# EAGLE schematic eletric (EAGLE 9.6.2)
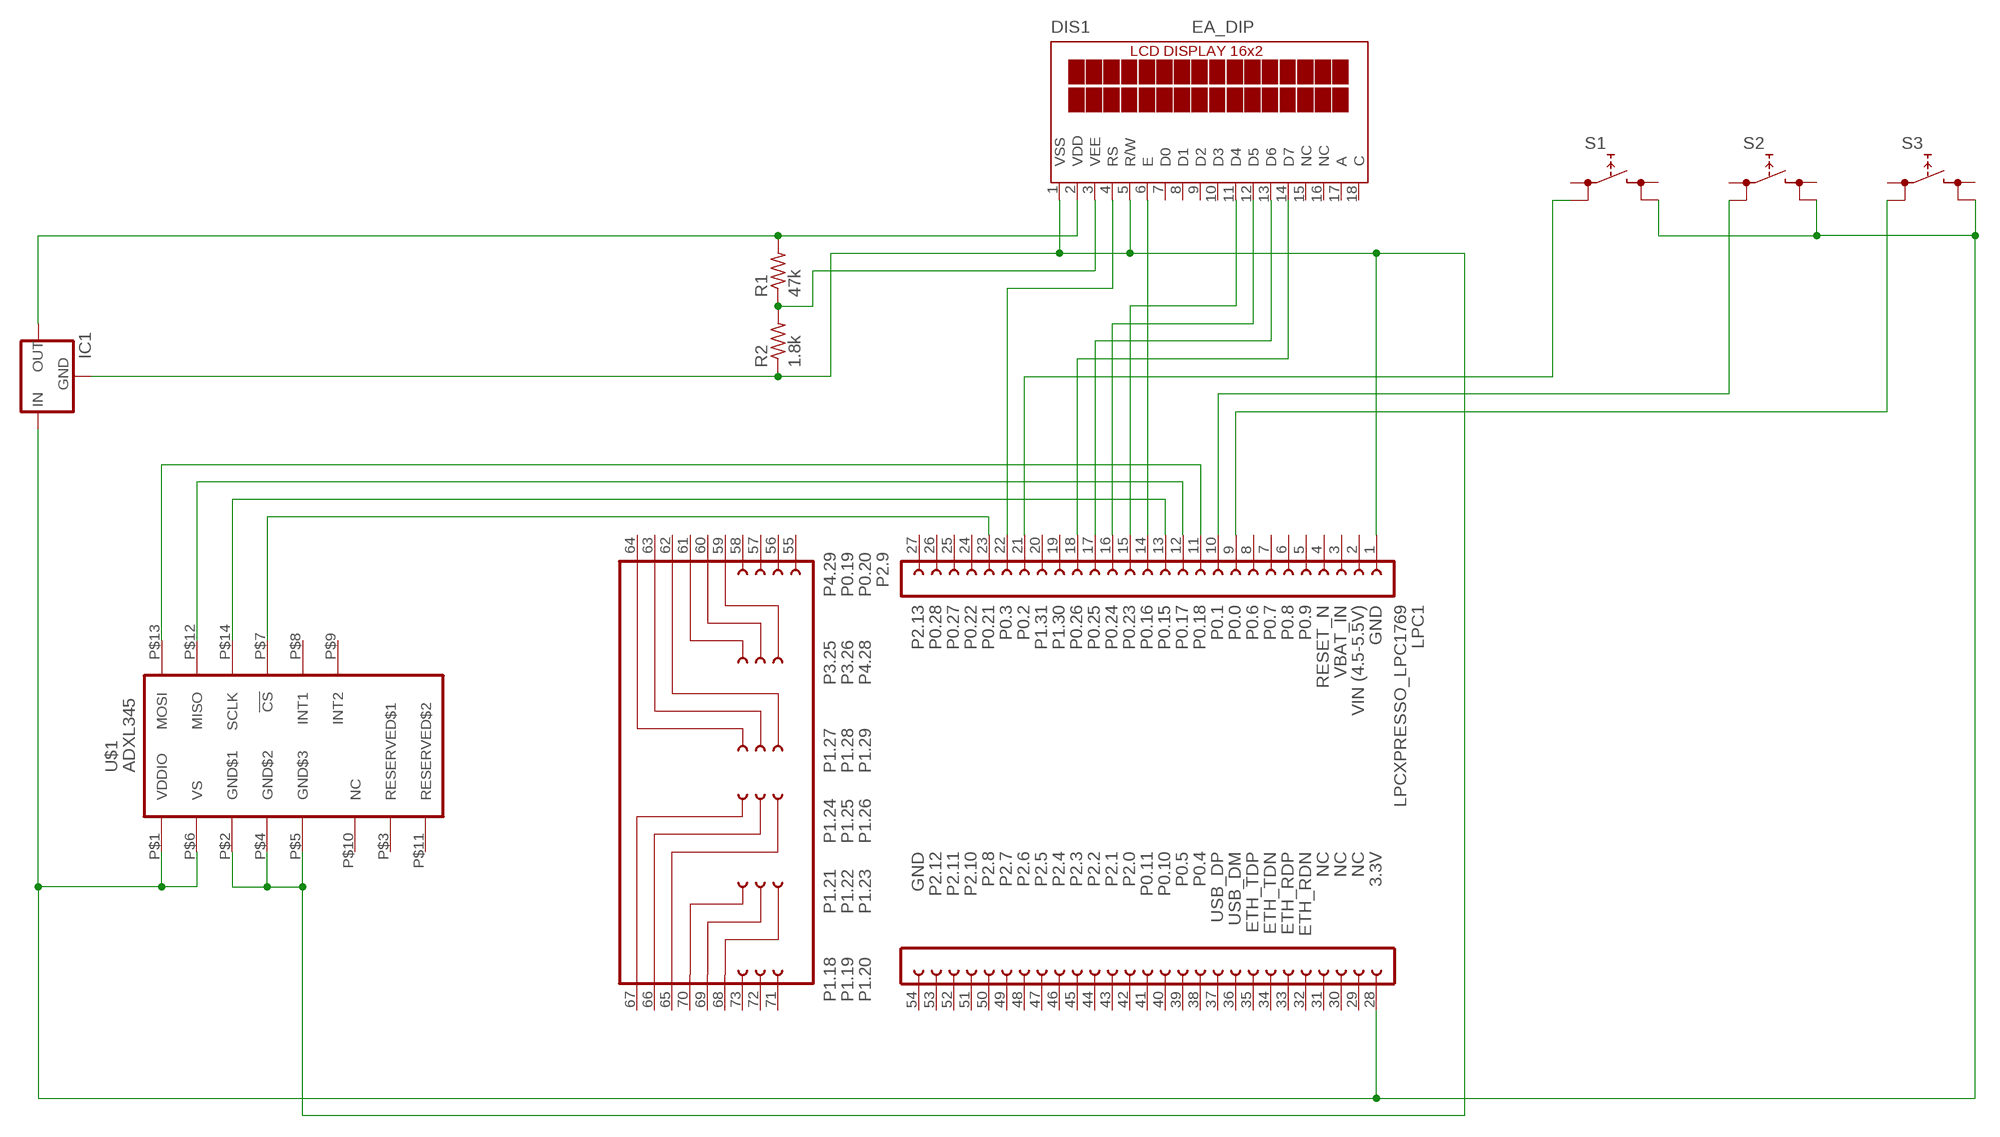
[diagram p0: schematic, sheet 1]

## Parts
DIS1  EA_DIP  [EA_DIP]
IC1  78MXXL  [78MXXL]
LPC1  LPCXPRESSO_LPC1769  [LPCXPRESSO_LPC1769]
R1  47k  R-US_0204/2V  [0204V]
R2  1.8k  R-US_0204/2V  [0204V]
S1  REKN  [REKN]
S2  REKN  [REKN]
S3  REKN  [REKN]
U$1  ADXL345  [LGA14]

## Nets
N$1: DIS1.6(E) LPC1.14
N$2: DIS1.2(VDD) IC1.OUT R1.2
N$3: DIS1.11(D4) LPC1.15
N$4: DIS1.12(D5) LPC1.16
N$5: DIS1.13(D6) LPC1.17
N$6: DIS1.14(D7) LPC1.18
N$7: DIS1.3(VEE) R1.1 R2.2
N$8: DIS1.4(RS) LPC1.22
N$9: DIS1.1(VSS) DIS1.5(R/W) IC1.GND LPC1.1 R2.1 U$1.P$2(GND$1) U$1.P$4(GND$2) U$1.P$5(GND$3)
N$10: LPC1.23 U$1.P$7(!CS)
N$11: IC1.IN LPC1.28 S1.1B S2.1B S3.1B U$1.P$1(VDDIO) U$1.P$6(VS)
N$12: LPC1.13 U$1.P$14(SCLK)
N$13: LPC1.12 U$1.P$12(MISO)
N$14: LPC1.11 U$1.P$13(MOSI)
N$16: LPC1.10 S2.0B
N$17: LPC1.21 S1.0B
N$18: LPC1.9 S3.0B
Unconnected: DIS1.7(D0) DIS1.8(D1) DIS1.9(D2) DIS1.10(D3) DIS1.15(NC) DIS1.16(NC) DIS1.17(A) DIS1.18(C) LPC1.2 LPC1.3 LPC1.4 LPC1.5 LPC1.6 LPC1.7 LPC1.8 LPC1.19 LPC1.20 LPC1.24 LPC1.25 LPC1.26 LPC1.27 LPC1.29 LPC1.30 LPC1.31 LPC1.32 LPC1.33 LPC1.34 LPC1.35 LPC1.36 LPC1.37 LPC1.38 LPC1.39 LPC1.40 LPC1.41 LPC1.42 LPC1.43 LPC1.44 LPC1.45 LPC1.46 LPC1.47 LPC1.48 LPC1.49 LPC1.50 LPC1.51 LPC1.52 LPC1.53 LPC1.54 LPC1.55 LPC1.56 LPC1.57 LPC1.58 LPC1.59 LPC1.60 LPC1.61 LPC1.62 LPC1.63 LPC1.64 LPC1.65 LPC1.66 LPC1.67 LPC1.68 LPC1.69 LPC1.70 LPC1.71 LPC1.72 LPC1.73 S1.0A S1.1A S2.0A S2.1A S3.0A S3.1A U$1.P$3(RESERVED$1) U$1.P$8(INT1) U$1.P$9(INT2) U$1.P$10(NC) U$1.P$11(RESERVED$2)

## Library data of the parts
DIS1 = display-lcd:EA_DIP: LCD-MODUL 2x16 - 6,68mm, INKL. KONTROLLER HD44780 Source: Data sheet <http://www.lcd-module.de/pdf/doma/dip162-d.pdf>
IC1 = v-reg:78MXXL: VOLTAGE REGULATOR
LPC1 = LPCXPRESSO_LPC1769:LPCXPRESSO_LPC1769; AVAILABILITY: Unavailable; DESCRIPTION: LPC1768, LPC1769, mbed-Enabled Development LPCXpresso™ LPC1700 ARM® Cortex®-M3 MCU 32-Bit Embedded Evaluation Board; MF: Embedded Artists; MP: LPCXPRESSO LPC1769; PACKAGE: None; PRICE: None
R1 R2 = rcl:R-US_: RESISTOR, American symbol; SPICEPREFIX: R
S1-S3 = switch:REKN: PUSH SWITCH ITT-Cannon-Cannon
U$1 = adxl345:ADXL345: 3-Axis, ±2 g/±4 g/±8 g/±16 g Digital Accelerometer